# Altium schematic sheet 12-MSP430.SchDoc
size A4
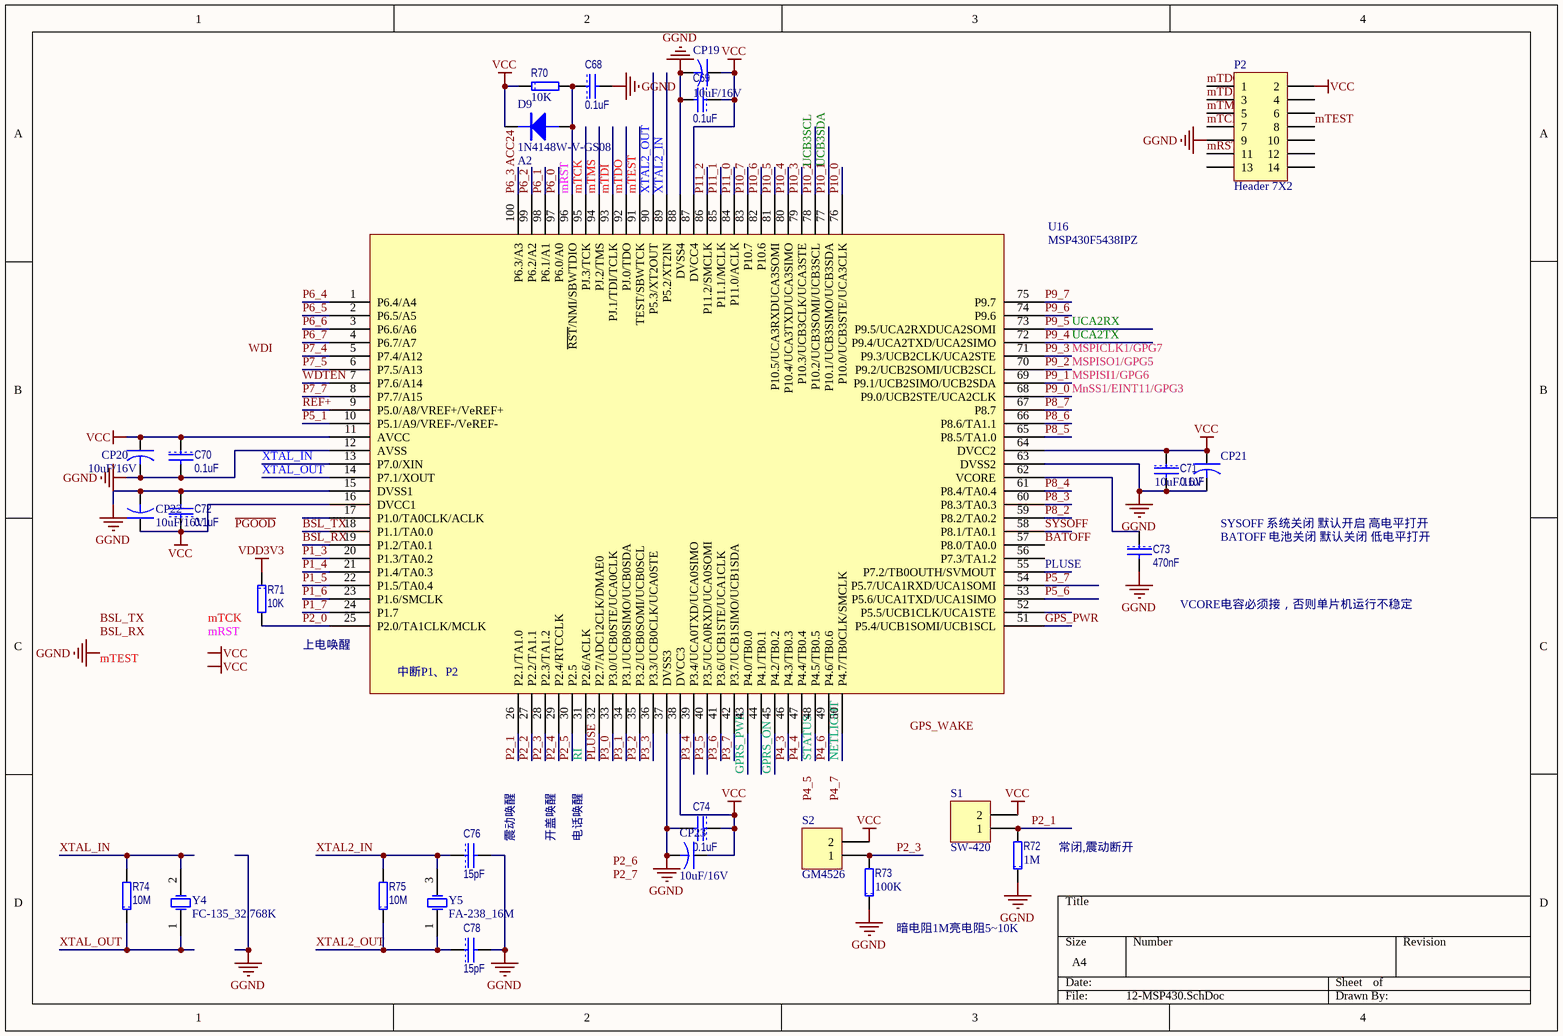
[diagram p0: 12-MSP430.SchDoc]

## Parts
C68  0.1uF  [1608[0603]]
C69  0.1uF  [1608[0603]]
C70  0.1uF  [1608[0603]]
C71  0.1uF  [1608[0603]]
C72  0.1uF  [1608[0603]]
C73  470nF  [1608[0603]]
C74  0.1uF  [1608[0603]]
C76  15pF  [1608[0603]]
C78  15pF  [1608[0603]]
CP19  10uF/16V  [3216[1206]]
CP20  10uF/16V  [3216[1206]]
CP21  10uF/16V  [3216[1206]]
CP22  10uF/16V  [3216[1206]]
CP23  10uF/16V  [3216[1206]]
D9  1N4148W-V-GS08  value A2  [SOD323]
P2  Header 7X2  [HDR2X7]
R70  value 10K  [1608[0603]R]  (hidden comment: CRCW060310K0FKEA)
R71  10K  [1608[0603]R]
R72  value 1M  [1608[0603]R]  (hidden comment: CRCW06031M00FKEA)
R73  value 100K  [1608[0603]R]  (hidden comment: CRCW0603100KFKEA)
R74  10M  [1608[0603]R]
R75  10M  [1608[0603]R]
S1  SW-420  [SW-420]
S2  GM4526  [GM4526]
U16  MSP430F5438IPZ  [TQFP100_N]
Y4  FC-135_32.768K  [FC-135]
Y5  FA-238_16M  [FA-238]

## Nets
GGND: C68.2 C69.2 C70.2 C71.2 C72.2 C73.2 C74.2 C76.2 C78.2 CP19.2 CP20.2 CP21.2 CP22.2 CP23.2 P2.9 R72.1 R73.1 U16.12(AVSS) U16.15(DVSS1) U16.37(DVSS3) U16.63(DVSS2) U16.88(DVSS4)
VCC: C69.1 C70.1 C71.1 C72.1 C74.1 CP19.1 CP20.1 CP21.1 CP22.1 CP23.1 D9.2(K) P2.2 R70.1 S1.2 S2.2 U16.11(AVCC) U16.16(DVCC1) U16.38(DVCC3) U16.64(DVCC2) U16.87(DVCC4)
VDD3V3: R71.1
ACC24: U16.100(P6.3/A3)  [also labelled P6_3]
BATOFF: U16.57(P8.0/TA0.0)
BSL_RX: U16.19(P1.2/TA0.1)
BSL_TX: U16.18(P1.1/TA0.0)
GPRS_ON: U16.45(P4.2/TB0.2)
GPRS_PWR: U16.43(P4.0/TB0.0)
GPS_PWR: U16.51(P5.4/UCB1SOMI/UCB1SCL)
MnSS1/EINT11/GPG3: U16.68(P9.0/UCB2STE/UCA2CLK)  [also labelled P9_0]
mRST: C68.1 D9.1(A) P2.11 R70.2 U16.96(~{RST}/NMI/SBWTDIO)
MSPICLK1/GPG7: U16.71(P9.3/UCB2CLK/UCA2STE)  [also labelled P9_3]
MSPISI1/GPG6: U16.69(P9.1/UCB2SIMO/UCB2SDA)  [also labelled P9_1]
MSPISO1/GPG5: U16.70(P9.2/UCB2SOMI/UCB2SCL)  [also labelled P9_2]
mTCK: P2.7 U16.95(PJ.3/TCK)
mTDI: P2.3 U16.93(PJ.1/TDI/TCLK)
mTDO: P2.1 U16.92(PJ.0/TDO)
mTEST: P2.8 U16.91(TEST/SBWTCK)
mTMS: P2.5 U16.94(PJ.2/TMS)
NETLIGHT: U16.50(P4.7/TB0CLK/SMCLK)
P1_3: U16.20(P1.3/TA0.2)
P1_4: U16.21(P1.4/TA0.3)
P1_5: U16.22(P1.5/TA0.4)
P1_6: U16.23(P1.6/SMCLK)
P1_7: U16.24(P1.7)
P2_0: R71.2 U16.25(P2.0/TA1CLK/MCLK)
P2_1: R72.2 S1.1 U16.26(P2.1/TA1.0)
P2_2: U16.27(P2.2/TA1.1)
P2_3: R73.2 S2.1 U16.28(P2.3/TA1.2)
P2_4: U16.29(P2.4/RTCCLK)
P2_5: U16.30(P2.5)
P3_0: U16.33(P3.0/UCB0STE/UCA0CLK)
P3_1: U16.34(P3.1/UCB0SIMO/UCB0SDA)
P3_2: U16.35(P3.2/UCB0SOMI/UCB0SCL)
P3_3: U16.36(P3.3/UCB0CLK/UCA0STE)
P3_4: U16.39(P3.4/UCA0TXD/UCA0SIMO)
P3_5: U16.40(P3.5/UCA0RXD/UCA0SOMI)
P3_6: U16.41(P3.6/UCB1STE/UCA1CLK)
P3_7: U16.42(P3.7/UCB1SIMO/UCB1SDA)
P4_3: U16.46(P4.3/TB0.3)
P4_4: U16.47(P4.4/TB0.4)
P4_6: U16.49(P4.6/TB0.6)
P5_1: U16.10(P5.1/A9/VREF-/VeREF-)
P5_6: U16.53(P5.6/UCA1TXD/UCA1SIMO)
P5_7: U16.54(P5.7/UCA1RXD/UCA1SOMI)
P6_0: U16.97(P6.0/A0)
P6_1: U16.98(P6.1/A1)
P6_2: U16.99(P6.2/A2)
P6_4: U16.1(P6.4/A4)
P6_5: U16.2(P6.5/A5)
P6_6: U16.3(P6.6/A6)
P6_7: U16.4(P6.7/A7)
P7_4: U16.5(P7.4/A12)
P7_5: U16.6(P7.5/A13)
P7_7: U16.8(P7.7/A15)
P8_2: U16.59(P8.2/TA0.2)
P8_3: U16.60(P8.3/TA0.3)
P8_4: U16.61(P8.4/TA0.4)
P8_5: U16.65(P8.5/TA1.0)
P8_6: U16.66(P8.6/TA1.1)
P8_7: U16.67(P8.7)
P9_4: U16.72(P9.4/UCA2TXD/UCA2SIMO)  [also labelled UCA2TX]
P9_5: U16.73(P9.5/UCA2RXDUCA2SOMI)  [also labelled UCA2RX]
P9_6: U16.74(P9.6)
P9_7: U16.75(P9.7)
P10_0: U16.76(P10.0/UCB3STE/UCA3CLK)
P10_1: U16.77(P10.1/UCB3SIMO/UCB3SDA)  [also labelled UCB3SDA]
P10_2: U16.78(P10.2/UCB3SOMI/UCB3SCL)  [also labelled UCB3SCL]
P10_3: U16.79(P10.3/UCB3CLK/UCA3STE)
P10_4: U16.80(P10.4/UCA3TXD/UCA3SIMO)
P10_5: U16.81(P10.5/UCA3RXDUCA3SOMI)
P10_6: U16.82(P10.6)
P10_7: U16.83(P10.7)
P11_0: U16.84(P11.0/ACLK)
P11_1: U16.85(P11.1/MCLK)
P11_2: U16.86(P11.2/SMCLK)
PLUSE: U16.32(P2.7/ADC12CLK/DMAE0) U16.55(P7.2/TB0OUTH/SVMOUT)
REF+: U16.9(P5.0/A8/VREF+/VeREF+)
RI: U16.31(P2.6/ACLK)
STATUS: U16.48(P4.5/TB0.5)
SYSOFF: U16.58(P8.1/TA0.1)
WDTEN: U16.7(P7.6/A14)
XTAL2_IN: C76.1 R75.2 U16.89(P5.2/XT2IN) Y5.3(OSC2)
XTAL2_OUT: C78.1 R75.1 U16.90(P5.3/XT2OUT) Y5.1(OSC1)
XTAL_IN: R74.2 U16.13(P7.0/XIN) Y4.2(OSC2)
XTAL_OUT: R74.1 U16.14(P7.1/XOUT) Y4.1(OSC1)
NetC73_1: C73.1 U16.62(VCORE)

Not connected (* = marked no-connect by the designer): P2 4 6 10 12 13 14; U16 17(P1.0/TA0CLK/ACLK) 44(P4.1/TB0.1) 52(P5.5/UCB1CLK/UCA1STE) 56(P7.3/TA1.2)

## Notes on the sheet
- BATOFF 电池关闭 默认关闭 低电平打开
- SYSOFF 系统关闭 默认开启 高电平打开
- 上电唤醒
- VCORE电容必须接，否则单片机运行不稳定
- (near U16) 中断P1、P2
- (near C76) 震动唤醒
- 开盖唤醒
- 电话唤醒
- (near R72) 常闭,震动断开
- (near R73) 暗电阻1M亮电阻5~10K
- Labels drawn without touching a wire or pin: BSL_RX, BSL_TX, GGND, GPS_WAKE, mRST, mTCK, mTEST, P2_6, P2_7, P4_5, P4_7, VCC, WDI, ~{PGOOD}

## Library data of the parts
C68-C72 C74 = CAP: Capacitor; Manufacturer: TDK; Type: 无铅电容; Model: C0603X7R1H104K; Value: 0.1uF
C73 = CAP: Capacitor; Manufacturer: TDK; Type: 无铅电容; Model: C0603X7R1H474K; Value: 470nF
C76 C78 = CAP: Capacitor; Manufacturer: TDK; Type: 无铅电容; Model: C0603X7R1H150K; Value: 15pF
CP19-CP23 = CAPACITOR: Tantalum Capacitor; 公司: TAJ; name: TAJ-A-106-M-010-R; value: 10uF/16V
D9 = 1N4148W: 二极管 - 通用，功率，开关 100V Io/150mA; Manufacturer: Vishay Semiconductors; 配置: Single; 工作温度范围: - 65 C to + 150 C; 封装 / 箱体: SOD-123; 封装: Reel; 产品: Switching Diodes; 正向连续电流: 0.15 A; 最大浪涌电流: 0.5 A; 安装风格: SMD/SMT; 恢复时间: 4 ns; 正向电压下降: 1.2 V; 制造商: Vishay; 最大二极管电容: 4 pF; 最大工作温度: + 150 C; 最大功率耗散: 350 mW; 最大反向漏泄电流: 5 uA; 最小工作温度: - 65 C; 标准包装数量: 15000; Supplier 1: Mouser; Supplier Part Number 1: 625-1N4148W-V; Manufacturer Part Number: 1N4148W-V-GS08; RoHS: RoHS Compliant; Category: 二极管 - 通用，功率，开关; Stock 1: 404148; Pricing 1: 1=0.090, 10=0.083, 50=0.072, 100=0.068, 500=0.032, 1000=0.026, 3000=0.021, 9000=0.016, 10000=0.016, 18000=0.014 (USD); 峰值反向电压: 100 V; 产品种类: Switching Diodes; RoHS - 贸泽: Y; Minimum Order Quantity: 1; Reeling: True; ComponentLink1URL: http://www.mouser.com/ds/2/427/1n4148w--240387.pdf; ComponentLink1Description: http://www.mouser.com/ds/2/427/1n4148w--240387.pdf; Description 1: 二极管 - 通用，功率，开关 100V Io/150mA
P2 = Header 7X2: Header, 7-Pin, Dual row; LatestRevisionDate: 17-Jul-2002; LatestRevisionNote: Re-released for DXP Platform.; Publisher: Altium Limited
R70 = RES: 厚膜电阻器 - SMD 1/10watt 10Kohms 1%; Manufacturer: Vishay / Dale; 尺寸: 0.85 mm W x 1.55 mm L x 0.45 mm H; 工作温度范围: - 55 C to + 155 C; 封装 / 箱体: 0603 (1608 metric); 封装: Reel; 功率额定值: 100 mW; 产品: Thick Film Resistors SMD; 系列: CRCW; 温度系数: 100 PPM / K; 端接类型: SMD/SMT; 电压额定值: 75 V; 制造商: Vishay; 产品种类: 0603 Thick Film Chip Resistors; 标准包装数量: 5000; 外壳代码 - in: 0603; 外壳代码 - mm: 1608; Supplier 1: Mouser; Supplier Part Number 1: 71-CRCW0603-10K-E3; Manufacturer Part Number: CRCW060310K0FKEA; RoHS: RoHS Compliant By Exemption; Category: 厚膜电阻器 - SMD; Stock 1: 0; Pricing 1: 1=0.080, 10=0.013, 100=0.010, 1000=0.008, 5000=0.005, 25000=0.004, 50000=0.003 (USD); 电阻: 10 kOhms; 容差: 1 %; RoHS - 贸泽: E; Minimum Order Quantity: 1; Reeling: True; ComponentLink1URL: http://www.mouser.com/ds/2/427/dcrcwe3-109170.pdf; ComponentLink1Description: http://www.mouser.com/ds/2/427/dcrcwe3-109170.pdf; Description 1: 厚膜电阻器 - SMD 1/10watt 10Kohms 1%
R71 = RES: Model: RT0603DRD7D10KL; 公司: vishay; Parameters: 50V 1/10W 0.5%; Type: 无铅电阻; Value: 10K
R72 = RES: 厚膜电阻器 - SMD 1/10watt 1.0Mohms 1%; Manufacturer: Vishay / Dale; 尺寸: 0.85 mm W x 1.55 mm L x 0.45 mm H; 工作温度范围: - 55 C to + 155 C; 封装 / 箱体: 0603 (1608 metric); 封装: Reel; 功率额定值: 100 mW; 产品: Thick Film Resistors SMD; 电阻: 1 MOhms; 系列: CRCW; 温度系数: 100 PPM / K; 端接类型: SMD/SMT; 电压额定值: 75 V; 外壳代码 - in: 0603; 外壳代码 - mm: 1608; 制造商: Vishay; 产品种类: 0603 Thick Film Chip Resistors; 标准包装数量: 5000; Supplier 1: Mouser; Supplier Part Number 1: 71-CRCW0603-1.0M-E3; Manufacturer Part Number: CRCW06031M00FKEA; RoHS: RoHS Compliant By Exemption; Category: 厚膜电阻器 - SMD; Stock 1: 71394; Pricing 1: 1=0.080, 10=0.013, 100=0.010, 1000=0.008, 5000=0.005, 25000=0.004, 50000=0.003 (USD); 容差: 1 %; RoHS - 贸泽: E; Minimum Order Quantity: 1; Reeling: True; ComponentLink1URL: http://www.mouser.com/ds/2/427/dcrcwe3-109170.pdf; ComponentLink1Description: http://www.mouser.com/ds/2/427/dcrcwe3-109170.pdf; Description 1: 厚膜电阻器 - SMD 1/10watt 1.0Mohms 1%
R73 = RES: 厚膜电阻器 - SMD 1/10watt 100Kohms 1%; Manufacturer: Vishay / Dale; 尺寸: 0.85 mm W x 1.55 mm L x 0.45 mm H; 工作温度范围: - 55 C to + 155 C; 封装 / 箱体: 0603 (1608 metric); 封装: Reel; 功率额定值: 100 mW; 产品: Thick Film Resistors SMD; 系列: CRCW; 温度系数: 100 PPM / K; 端接类型: SMD/SMT; 电压额定值: 75 V; 制造商: Vishay; 产品种类: 0603 Thick Film Chip Resistors; 标准包装数量: 5000; 外壳代码 - in: 0603; 外壳代码 - mm: 1608; Supplier 1: Mouser; Supplier Part Number 1: 71-CRCW0603-100K-E3; Manufacturer Part Number: CRCW0603100KFKEA; RoHS: RoHS Compliant By Exemption; Category: 厚膜电阻器 - SMD; Stock 1: 175756; Pricing 1: 1=0.080, 10=0.013, 100=0.010, 1000=0.008, 5000=0.005, 25000=0.004, 50000=0.003 (USD); 电阻: 100 kOhms; 容差: 1 %; RoHS - 贸泽: E; Minimum Order Quantity: 1; Reeling: True; ComponentLink1URL: http://www.mouser.com/ds/2/427/dcrcwe3-109170.pdf; ComponentLink1Description: http://www.mouser.com/ds/2/427/dcrcwe3-109170.pdf; Description 1: 厚膜电阻器 - SMD 1/10watt 100Kohms 1%
R74 R75 = RES: Model: RT0603DRD7D10ML; 公司: vishay; Parameters: 50V 1/10W 0.5%; Type: 无铅电阻; Value: 10M
S1 = Header 2: 插针 工业级震动传感器; 公司: 百灵电子; LatestRevisionDate: 17-Jul-2002; LatestRevisionNote: Re-released for DXP Platform.; Publisher: Altium Limited
S2 = Header 2: 插针 光敏传感器; 公司: 百灵电子; LatestRevisionDate: 17-Jul-2002; LatestRevisionNote: Re-released for DXP Platform.; Publisher: Altium Limited
U16 = MSP430F5438: 处理器; 公司: TI
Y4 = XTAL: Crystal Oscillator; 公司: EPSON; Published: 8-Jun-2000; LatestRevisionDate: 17-Jul-2002; LatestRevisionNote: Re-released for DXP Platform.; PackageReference: R38; Publisher: Altium Limited; PackageDescription: Crystal, Thru-Hole; 2 Leads; Body 3.1 x 8.2 mm (Dia.xH); Value: 32.768K
Y5 = XTAL: Crystal Oscillator; 公司: EPSON; Value: 16M; Published: 8-Jun-2000; LatestRevisionDate: 17-Jul-2002; LatestRevisionNote: Re-released for DXP Platform.; PackageReference: R38; Publisher: Altium Limited; PackageDescription: Crystal, Thru-Hole; 2 Leads; Body 3.1 x 8.2 mm (Dia.xH)